# Altium schematic sheet Module1BrandonPollack.SchDoc
size Letter
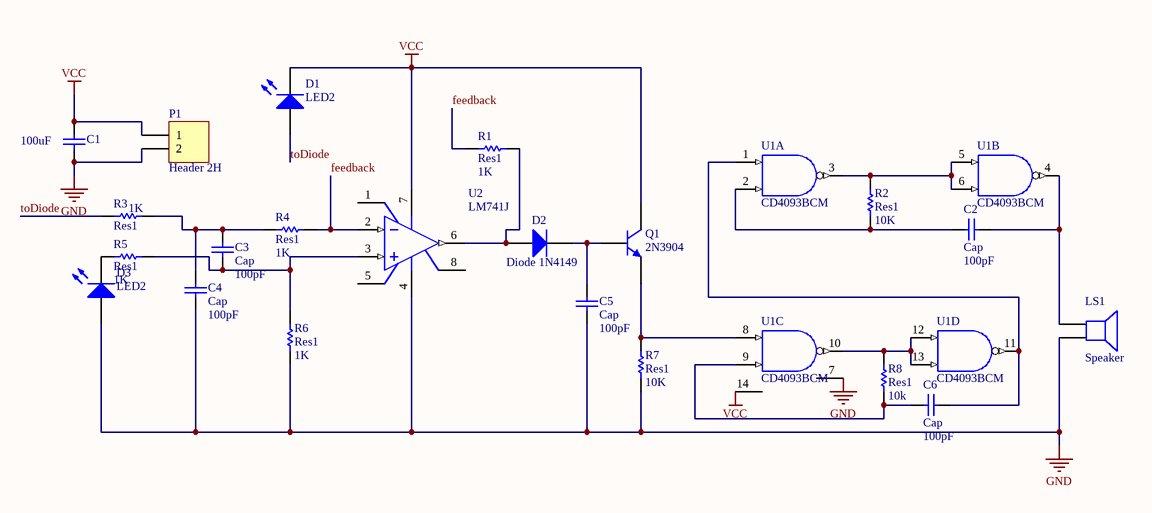
[diagram p0: Module1BrandonPollack.SchDoc]

## Parts
C1  value 100uF  [RAD-0.3]  (hidden comment: Cap)
C2  Cap  value 100pF  [0402]
C3  Cap  value 100pF  [0402]
C4  Cap  value 100pF  [0402]
C5  Cap  value 100pF  [0402]
C6  Cap  value 100pF  [0402]
D1  LED2  [3.2X1.6X1.1]
D2  Diode 1N4149  [DO-35A]
D3  LED2  [3.2X1.6X1.1]
LS1  Speaker  [PIN2]
P1  Header 2H  [HDR1X2H]
Q1  2N3904  [TO-92A]
R1  Res1  value 1K  [AXIAL-0.3]
R2  Res1  value 10K  [AXIAL-0.3]
R3  Res1  value 1K  [AXIAL-0.3]
R4  Res1  value 1K  [AXIAL-0.3]
R5  Res1  value 1K  [AXIAL-0.3]
R6  Res1  value 1K  [AXIAL-0.3]
R7  Res1  value 10K  [AXIAL-0.3]
R8  Res1  value 10k  [AXIAL-0.3]
U1  CD4093BCM  [M14A_N]  (parts A,B,C,D of 4)
U2  LM741J  [J08A]

## Nets
GND: C1.1 C4.1 C5.1 D3.1(A) LS1.2 P1.2 R6.1 R7.2 U1.7(GND) U2.4(V-)
VCC: C1.2 D1.2(K) P1.1 Q1.3(C) U1.14(VCC) U2.7(V+)
feedback: R1.2 R4.2 U2.2(IN-)
toDiode: D1.1(A) R3.1
NetC2_1: C2.1 R2.1 U1.2(B)
NetC2_2: C2.2 LS1.1 U1.4(K)
NetC3_1: C3.1 R5.2 R6.2 U2.3(IN+)
NetC3_2: C3.2 C4.2 R3.2 R4.1
NetC5_2: C5.2 D2.2(K) Q1.2(B)
NetC6_1: C6.1 R8.1 U1.9(F)
NetC6_2: C6.2 U1.1(A) U1.11(M)
NetD2_1: D2.1(A) R1.1 U2.6(OUT)
NetD3_2: D3.2(K) R5.1
NetQ1_1: Q1.1(E) R7.1 U1.8(E)
NetR2_2: R2.2 U1.3(J) U1.5(C) U1.6(D)
NetR8_2: R8.2 U1.10(L) U1.12(G) U1.13(H)

Not connected (* = marked no-connect by the designer): U2 1(OFS_NULL) 5(OFS_NULL) 8(NC)

## Library data of the parts
C1-C6 = Cap: Capacitor; Published: 8-Jun-2000; LatestRevisionDate: 17-Jul-2002; LatestRevisionNote: Re-released for DXP Platform.; PackageReference: RAD-0.3; Publisher: Altium Limited; PackageDescription: Radial Cap, Thru-Hole; 2 Leads; 0.3 in Pin Spacing
D1 D3 = LED2: Typical RED, GREEN, YELLOW, AMBER GaAs LED; Published: 8-Jun-2000; LatestRevisionDate: 17-Jul-2002; LatestRevisionNote: Re-released for DXP Platform.; PackageVersion: Feb-2002; PackageReference: 3.2X1.6X1.1; Publisher: Altium Limited; PackageDescription: SM LED; 2 Flat Leads
D2 = Diode 1N4149: Computer Diode; Published: 8-Jun-2000; LatestRevisionDate: 17-Jul-2002; LatestRevisionNote: Re-released for DXP Platform.; DatasheetVersion: 1989; PackageVersion: 1989; PackageReference: DO-35A; Publisher: Altium Limited; PackageDescription: Diode, Axial; Body 4.6 x 1.9 mm (LxDia. max), Lead Dia. 0.53 mm (max); Code_JEDEC: DO-204-AH; ComponentLink1Description: Manufacturer Link; ComponentLink1URL: http://www.national.com/
LS1 = Speaker: Loudspeaker; Published: 24-Mar-1999; LatestRevisionDate: 17-Jul-2002; LatestRevisionNote: Re-released for DXP Platform.; PackageReference: PIN2; Publisher: Altium Limited
P1 = Header 2H: Header, 2-Pin, Right Angle; LatestRevisionDate: 17-Jul-2002; LatestRevisionNote: Re-released for DXP Platform.; Publisher: Altium Limited
Q1 = 2N3904: NPN General Purpose Amplifier; Published: 8-Jun-2000; LatestRevisionDate: 15-Jan-2003; LatestRevisionNote: PCB Footprint 'BCY-W3/D4.7' replaced; DatasheetVersion: 1997; PackageVersion: Sep-1998; PackageReference: TO-92A; Publisher: Altium Limited; PackageDescription: TO, Flat Index; 3 In-Line, Axial Leads; Body Dia. 4.5mm; Leads 0.51 x 0.48 mm (max); ComponentLink1Description: Manufacturer Link; ComponentLink1URL: http://www.fairchildsemi.com/; ComponentLink2Description: Datasheet; ComponentLink2URL: http://www.fairchildsemi.com/ds/2N%2F2N3904.pdf
R1-R8 = Res1: Resistor; Published: 8-Jun-2000; LatestRevisionDate: 17-Jul-2002; LatestRevisionNote: Re-released for DXP Platform.; PackageReference: AXIAL-0.3; Publisher: Altium Limited; PackageDescription: Axial Device, Thru-Hole; 2 Leads; 0.3 in Pin Spacing
U1 = CD4093BCM: Quad 2-Input Schmitt-Trigger NAND Gate, 14-Pin SOIC; IC_Technology: C; Published: 17-Jul-2002; LatestRevisionDate: 13-Apr-2006; LatestRevisionNote: IPC-7351 Footprint Added.; DatasheetVersion: Jan-1999; PackageVersion: 2000; PackageReference: M14A; Publisher: Altium Limited; PackageDescription: 14-Pin Small Outline Integrated Circuit 1.27 mm Pitch; Code_IPC: SOIC127P600-14; ComponentLink1Description: Manufacturer Link; ComponentLink1URL: http://www.fairchildsemi.com/; ComponentLink2Description: Datasheet; ComponentLink2URL: http://www.fairchildsemi.com/ds/CD%2FCD4093BC.pdf
U2 = LM741J: Operational Amplifier, 8-pin CerDIP; Manufacturer: National Semiconductor; PackageTopMarking: NSUZXYTT*LM741J; PowerWise: N; CompType: Amplifiers; High-Reliability: Y; Published: 4-Dec-2008; LatestRevisionDate: 13-Jan-2009; LatestRevisionNote: Sim Model Added.; DatasheetVersion: Aug-2000; PackageVersion: revM, Jul-2002; PackageReference: J08A; Publisher: Altium Limited; PackageDescription: Cerdip, .400 x .310in Body, 8 Lead, .300in Centers, .100in Pitch; Supplier 1: Digi-Key; Supplier Part Number 1: LM741J-ND; PartNumber: LM741J; RoHS: N; PinCount: 8; ComponentLink1Description: LM741 Datasheet; ComponentLink1URL: http://www.national.com/ds/LM/LM741.pdf; ComponentLink2Description: LM741 Web Page; ComponentLink2URL: http://www.national.com/pf/LM/LM741.html; ComponentLink3Description: J08A Package Page; ComponentLink3URL: http://www.national.com/packaging/folders/j08a.html